# Altium schematic sheet LTC3862-2.SchDoc
size 431 x 279 mm; SheetNumber: 2; SheetTotal: 4
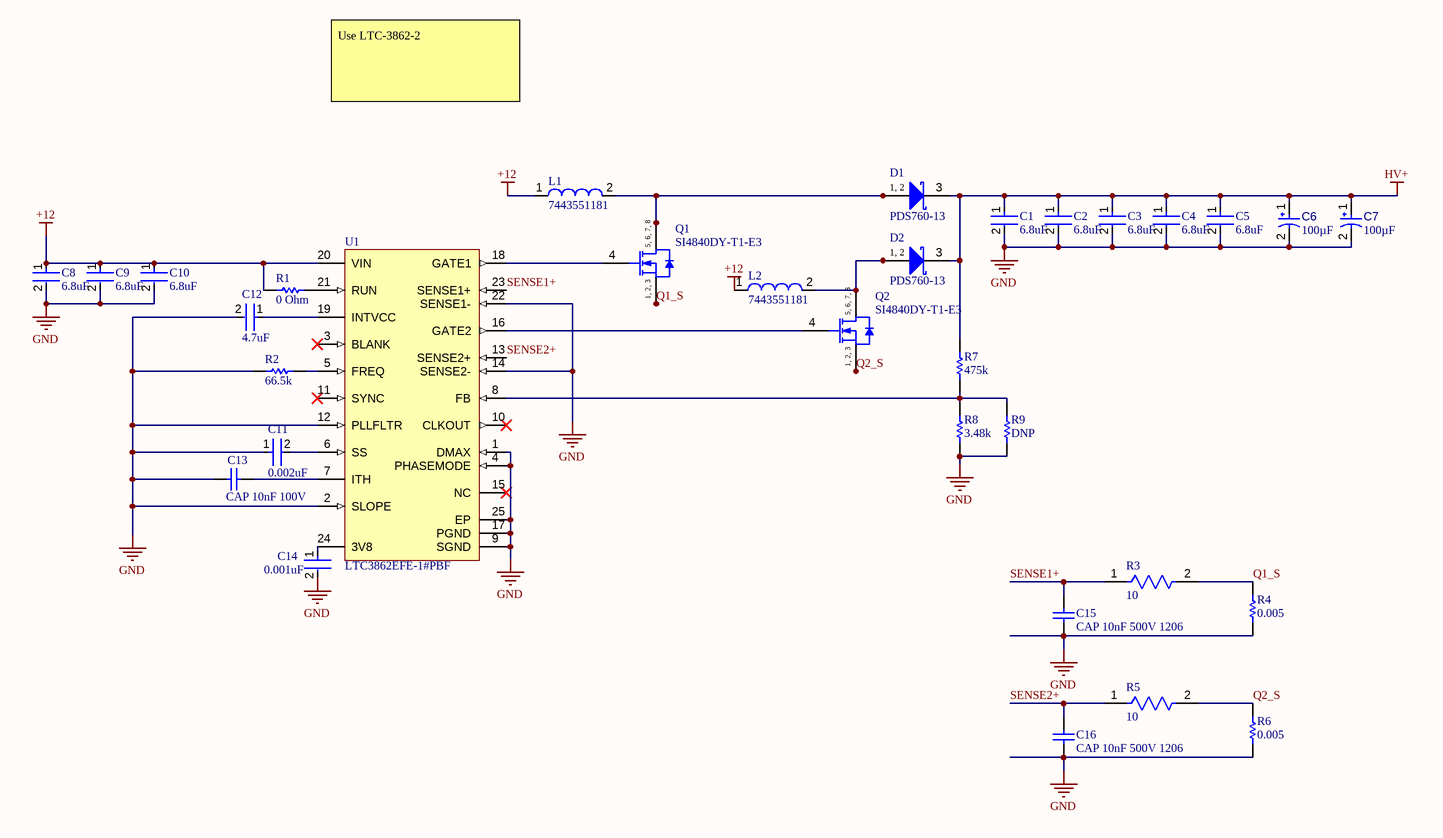
[diagram p0: LTC3862-2.SchDoc]

## Parts
C1  6.8uF  [FP-C3216-160-0_2-MFG]
C2  6.8uF  [FP-C3216-160-0_2-MFG]
C3  6.8uF  [FP-C3216-160-0_2-MFG]
C4  6.8uF  [FP-C3216-160-0_2-MFG]
C5  6.8uF  [FP-C3216-160-0_2-MFG]
C6  value 100µF  [CAPPR65-500-1600X1000X1700]  (hidden comment: ECA-2DM101)
C7  value 100µF  [CAPPR65-500-1600X1000X1700]  (hidden comment: ECA-2DM101)
C8  6.8uF  [FP-C3216-160-0_2-IPC_B]
C9  6.8uF  [FP-C3216-160-0_2-IPC_B]
C10  6.8uF  [FP-C3216-160-0_2-IPC_B]
C11  0.002uF  [FP-C1206C-EB-MFG]
C12  4.7uF  [FP-GRM31C-0_2-e0_3_0_8-IPC_C]
C13  CAP 10nF 100V  [CAPC1206(3216)170_N]
C14  0.001uF  [FP-C1206C-EB-MFG]
C15  CAP 10nF 500V 1206  [CAPC1206(3216)170_N]
C16  CAP 10nF 500V 1206  [CAPC1206(3216)170_N]
D1  PDS760-13  [DIOD-POWERDI5-3_V]
D2  PDS760-13  [DIOD-POWERDI5-3_V]
L1  7443551181  [WE-HCI-1365]
L2  7443551181  [WE-HCI-1365]
Q1  SI4840DY-T1-E3  [VISH-SOIC-8_A_V]
Q2  SI4840DY-T1-E3  [VISH-SOIC-8_A_V]
R1  0 Ohm  [RESC3216X89X64LL25T25]
R2  66.5k  [RESC3216X70X50NL05T20]
R3  10  [FP-CRCW1206-e3-IPC_A]
R4  0.005  [RESC3216X89X64LL25T25]
R5  10  [FP-CRCW1206-e3-IPC_A]
R6  0.005  [RESC3216X89X64LL25T25]
R7  475k  [RESC3216X60X45LL10T20]
R8  3.48k  [RESC3216X70X50LL05T20]
R9  DNP  [RESC3216X70X50LL05T20]
U1  LTC3862EFE-1#PBF  [LT-FE-24-EPV-AA_M]

## Nets
+12: C8.1 C9.1 C10.1 L1.1 L2.1 R1.1 U1.20(VIN)
GND: C1.2 C2.2 C3.2 C4.2 C5.2 C6.2 C7.2 C8.2 C9.2 C10.2 C11.1 C12.2 C13.2 C14.2 C15.2 C16.2 R2.1 R4.1 R6.1 R8.1 R9.1 U1.1(DMAX) U1.2(SLOPE) U1.4(PHASEMODE) U1.9(SGND) U1.12(PLLFLTR) U1.14(SENSE2-) U1.17(PGND) U1.22(SENSE1-) U1.25(EP)
HV+: C1.1 C2.1 C3.1 C4.1 C5.1 C6.1 C7.1 D1.3(K) D2.3(K) R7.2
Q1_S: Q1.1(S) Q1.2(S) Q1.3(S) R3.2 R4.2
Q2_S: Q2.1(S) Q2.2(S) Q2.3(S) R5.2 R6.2
SENSE1+: C15.1 R3.1 U1.23(SENSE1+)
SENSE2+: C16.1 R5.1 U1.13(SENSE2+)
NetC11_2: C11.2 U1.6(SS)
NetC12_1: C12.1 U1.19(INTVCC)
NetC13_1: C13.1 U1.7(ITH)
NetC14_1: C14.1 U1.24(3V8)
NetD1_1: D1.1(A) D1.2(A) L1.2 Q1.5(D) Q1.6(D) Q1.7(D) Q1.8(D)
NetD2_1: D2.1(A) D2.2(A) L2.2 Q2.5(D) Q2.6(D) Q2.7(D) Q2.8(D)
NetQ1_4: Q1.4(G) U1.18(GATE1)
NetQ2_4: Q2.4(G) U1.16(GATE2)
NetR1_2: R1.2 U1.21(RUN)
NetR2_2: R2.2 U1.5(FREQ)
NetR7_1: R7.1 R8.2 R9.2 U1.8(FB)

Not connected (* = marked no-connect by the designer): U1 3(BLANK)* 10(CLKOUT)* 11(SYNC)* 15(NC)*

## Notes on the sheet
- Use LTC-3862-2
- DWG. NO.
- REV.
- SHT.
- THIS DOCUMENT AND THE DATA DISCLOSED HEREIN OR HEREWITH IS THE PROPERTY OF ALTIUM LIMITED AND MAY BE FREELY DISTRIBUTED IN WHOLE. NO RIGHTS ARE RESERVED OR EXPRESS OR IMPLIED WARANTEE GIVEN.
- REVISION
- DESCRIPTION
- DATE
- APPROVED
- ENG:
- APPROVALS
- PROJECT
- DSN:
- CHK:
- REFERENCE DOCUMENTS
- PROJECT REVISION:
- TITLE
- DOCUMENT REVISION:
- DESIGN ITEM:
- BOM:
- FAB DWG:
- PCB DWG:
- ASSY DWG:
- SCALE:
- SIZE
- B
- CAGE CODE
- FILE NAME
- DWG NO.
- SHEET
- OF
- REV
- (in symbol CMP-2000-07056-1) 5, 6, 7, 8; 1, 2, 3
- (in symbol CMP-2000-07476-1) 1, 2

## Library data of the parts
C1-C5 = CMP-08246-003319-1: Multilayer Ceramic Capacitors 6.8uF ±20% 50V X5R SMD 1206 / C3216X5R1H685M160AB; Max Operating Temperature: 85°C; Min Operating Temperature: -55°C; Resistor Type: Ceramic; Thickness: 0.071inch; Capacitance: 6.8uF; Voltage Rating (DC): 50V; Length: 3.2mm; RoHS Compliant: Yes; Case/Package: 1206; Case Code (Metric): 3216; Series: C; Termination: SMD/SMT; Package Quantity: 1; Dielectric Material: Ceramic; Depth: 1.6mm; Mount: Surface Mount; Height: 1.6mm; Dielectric: X5R; Weight: 0.000571oz; Packaging: Tape and Reel; Lead Free: Lead Free; Tolerance: 20%; Construction: Flat; Width: 0.063inch; Case Code (Imperial): 1206; Voltage Rating: 50V
C6 C7 = CMP-001-00034-5: Aluminum Electrolytic Capacitor, 100 uF, +/- 20%, 200 V, -40 to 85 degC, 2-Pin THD, RoHS, Bulk; Manufacturer: Panasonic; Voltage Rating: 100V; Ripple Current (AC): 350mA; Mounting Technology: TH; RoHS Compliant: True; Package Reference: CAPPR65-500-1600X1000X1700; Lead Pitch: 5mm; Manufacturer URL: http://www.panasonic.com/; Min Operating Temperature: -40°C; Package Quantity: 200; Capacitor Type: Electrolytic; Diameter: 10mm; Packaging: Bulk; Datasheet URL: https://industrial.panasonic.com/cdbs/www-data/pdf/RDF0000/ABA0000C1047.pdf; Max Operating Temperature: 85°C; Pins: 2; Case/Package: Radial; Package Description: 2-Pin Through Hole Device, Dia 10 mm, Body Length 16 mm; Ripple Current: 350mA; Tolerance: 20%; Datasheet Version: Mar-16
C8-C10 = CMP-08246-003250-1: Multilayer Ceramic Capacitors 6.8uF ±10% 25V X7R SMD 1206 / C3216X7R1E685K160AB; Series: C; Construction: Flat; Max Operating Temperature: 125°C; Height: 1.6mm; Depth: 1.6mm; REACH SVHC: No SVHC; Lead Free: Lead Free; Dielectric Material: Ceramic; Length: 3.2mm; Dielectric: X7R; RoHS Compliant: Yes; Package Quantity: 1; Number of Pins: 2; Termination: SMD/SMT; Capacitance: 6.8uF; Min Operating Temperature: -55°C; Voltage Rating: 25V; Tolerance: 10%; Width: 0.063inch; Case Code (Imperial): 1206; Mount: Surface Mount; Resistor Type: Ceramic; Packaging: Tape and Reel; Weight: 0.000571oz; Voltage Rating (DC): 25V; Case/Package: 1206; Thickness: 0.075inch; Case Code (Metric): 3216
C11 = CMP-1037-02760-2: C1206 2,000 pF C0G 5.00% 100 V / C1206C202J1GACTU; Manufacturer: KEMET; Voltage Rating: 100 V; Tolerance: 0.05; Temperature Coefficient: 15%; Material: Ceramic; Automotive Grade: Grade 0; ComponentLink2URL: https://content.kemet.com/datasheets/KEM_C1007_X8R_ULTRA_150C_SMD.pdf; Device Class L3: Ceramic Capacitors; Temperature Characteristic: C0G; Category: Cap; RoHS: TRUE; Mouser Description: Cap Ceramic 0.002uF 100V C0G 5% SMD 1206 125°C Plastic T/R; Temperature Range Low: -55°C; Device Class L2: Capacitors; Temperature: -55°C to +150°C; Temperature Range High: +150°C; Ipc Land Pattern Name: CAPC320160X78; ComponentLink2Description: Datasheet; Octopart: https://octopart.com/c1206c202j1gactu-kemet-16997314; Device Class L1: Passive Components; Capacitance: 2,000 pF; Automotive: Yes; Manufacturer Part Number: C1206C202J1GACTU; Package: C1206C-EB; Height: 0.88mm; Value: 2,000 pF; Lead Free: Yes
C12 = CMP-1037-04923-3: Chip Multilayer Ceramic Capacitors for General Purpose, 1206, 4.7uF, X7R, 15%, 10%, 50V; Height: 1.6mm; Voltage: 50V; Capacitance: 4.7uF; Lead Free: Lead Free; Max Operating Temperature: 125°C; Packaging: Tape and Reel; REACH SVHC: No SVHC; Voltage Rating: 50V; Mount: Surface Mount; Termination: SMD/SMT; Tolerance: 10%; Case/Package: 1206; Material: Ceramic; Depth: 1.6mm; Length: 3.2mm; Case Code (Metric): 3216; Voltage Rating (DC): 50V; Case Code (Imperial): 1206; Radiation Hardening: No; Width: 0.063inch; Thickness: 0.071inch; Package Quantity: 2000; Min Operating Temperature: -55°C; Dielectric: X7R
C13 = CMP-1037-03519-1: CAP 10nF 100V ±5% 1206 (3216 Metric) Thickness 1.7mm SMD; Tolerance: Â±5%; Case-EIA: 1206; Case-Metric: 3216; Rated Voltage: 100 V; Value: 10nF; Technology: SMT; Max Thickness: 1.7 mm
C14 = CMP-03020-027220-1: 1206 1000pF Ceramic Multilayer Capacitor; 50VDC; 125degC; C0G Dielec; +/-5% SMD / C1206C102J5GACTU; Manufacturer: KEMET; Value: 1,000 pF; Voltage Rating: 50 V; Temperature Coefficient: 15%; Automotive Grade: Grade 0; Tolerance: 0.05; RoHS: TRUE; Category: Cap; Manufacturer Part Number: C1206C102J5GACTU; Temperature Range Low: -55°C; Digikey Description: 1206 1000pF Ceramic Multilayer Capacitor; 50VDC; 125degC; C0G Dielec; +/-5% SMD; ComponentLink2URL: https://content.kemet.com/datasheets/KEM_C1007_X8R_ULTRA_150C_SMD.pdf; Device Class L1: Passive Components; Device Class L3: Ceramic Capacitors; Temperature Characteristic: C0G; ComponentLink2Description: Datasheet; Height: 0.88mm; Automotive: Yes; Mouser Description: Multilayer Ceramic Capacitors MLCC - SMD/SMT 50volts 1000pF C0G 5%; Material: Ceramic; Capacitance: 1,000 pF; Lead Free: Yes; Device Class L2: Capacitors; Octopart: https://octopart.com/c1206c102j5gactu-kemet-139939; Temperature: -55°C to +150°C; Temperature Range High: +150°C; Ipc Land Pattern Name: CAPC320160X78; Package: C1206C-EB
C15 C16 = CMP-1037-03540-1: CAP 10nF 500V ±10% 1206 (3216 Metric) Thickness 1.7mm SMD; Tolerance: Â±10%; Case-Metric: 3216; Case-EIA: 1206; Rated Voltage: 500 V; Value: 10nF; Max Thickness: 1.7 mm; Technology: SMT
D1 D2 = CMP-2000-07476-1: Schottky Barrier Rectifier, 60 V, 7 A, -65 to 150 degC, 3-Pin SMD, RoHS, Tape and Reel; Manufacturer: Diodes Inc; Max Repetitive Reverse Voltage (Vrrm): 60V; Element Configuration: CommonAnode; Max Forward Surge Current (Ifsm): 275A; Polarity: Standard; Forward Voltage: 620mV; Forward Current: 7A; Peak Reverse Current: 200uA; Case\/Package: SMD/SMT; Manufacturer URL: http://www.diodes.com/; Reverse Voltage (DC): 60V; Lead Free: LeadFree; Voltage Rating (DC): 60V; Min Operating Temperature: -65degC; Package Description: 3-Pin Surface Mount Device, Body 3.975 x 5.375 mm, Pitch 1.84 mm; Length: 4.05mm; Datasheet URL: https://www.diodes.com/assets/Datasheets/ds30477.pdf; REACH SVHC: NoSVHC; Peak Non-Repetitive Surge Current: 275A; Output Current: 7A; Contact Plating: Matte; Mounting Technology: SurfaceMount; Mount: SurfaceMount; RoHSCompliant: true; Weight: 0.003386oz; Current Rating: 7A; Max Operating Temperature: 150degC; Package Quantity: 5000; Height: 1.15mm; Average Rectified Current: 7A; Datasheet Version: Rev. 13-2, 10/2012; Number of Pins: 5; Width: 5.45mm; Packaging: TapeandReel; Radiation Hardening: No; Package Reference: POWERDI5-3
L1 L2 = CMP-1351-00013-1: SMD Flat Wire High Current Inductor WE-HCI, L=18.0 µH; Manufacturer: Wuerth Elektronik; Inductance: 18.0 ÂµH; ComponentLink2URL: http://katalog.we-online.de/kataloge/eisos/media/pdf/7443551181.pdf; ComponentLink1URL: http://www.we-online.com; PartNumber: 7443551181; ComponentLink2Description: Datasheet; ComponentLink1Description: Manufacturer URL; PackageReference: WE-HCI-1365; PackageDescription: Inductor, 2-Leads, Body 13.2 x 12.8 mm
Q1 Q2 = CMP-2000-07056-1: N-Channel MOSFET, 40 V, -55 to 150 degC, 8-Pin SOIC, RoHS, Tape and Reel; Manufacturer: Vishay; Channel Type: N; Typical Gate Charge @ Vgs: 18.5nCV@5; Maximum Power Dissipation: 1.56W; Typical Turn-On Delay Time: 15ns; Configuration: QuadDrain,Single,TripleSource; Channel Mode: Enhancement; Typical Turn-Off Delay Time: 50ns; Maximum Drain Source Resistance: 0.009; Number of Elements per Chip: 1; Maximum Gate Source Voltage: 20V; Maximum Continuous Drain Current: 10A; Maximum Drain Source Voltage: 40V; Height: 1.55mm; Category: PowerMOSFET; Maximum Operating Temperature: +150C; Width: 4mm; Length: 5mm; Datasheet Version: Rev. E, 05/2009; Mounting Type: SurfaceMount; Package Type: SOICN; Dimensions: 5x4x1.55mm; Minimum Operating Temperature: -55C; Package Description: 8-Pin Small Outline Integrated Circuit, Body 4.9 x 3.9 mm, Pitch 1.27 mm; Pin Count: 8; Package Reference: SOIC-8; Datasheet URL: http://www.vishay.com/docs/71188/71188.pdf; Package URL: http://www.vishay.com/docs/71192/71192.pdf; Mounting Technology: SurfaceMount; Manufacturer URL: http://www.vishay.com/
R1 = CMP-2003-04332-1: 0 ohm 1206 / WSL120600000ZEA9; Manufacturer: Vishay Dale; Part Number: WSL120600000ZEA9
R2 = CMP-2003-00464-1: ERJ-8ENF6652V; Manufacturer: Panasonic; Part Number: ERJ-8ENF6652V
R3 R5 = CMP-2003-04815-2: RES Thick Film, 10Ω, 1%, 0.25W, 100ppm/°C, 1206 / CRCW120610R0FKEA; Power Rating: 250mW; Voltage Rating (DC): 200V; Resistance: 10R; Number of Terminations: 2; Width: 0.063inch; Case Code (Imperial): 1206; Depth: 1.6mm; Contact Plating: Tin; Radiation Hardening: No; Lead Free: Lead Free; Length: 3.2mm; Tolerance: 1%; Max Power Dissipation: 250mW; Composition: Thick Film; Weight: 0.000353oz; Case/Package: 1206; Number of Pins: 2; Package Quantity: 10; Min Operating Temperature: -55°C; Military Standard: Not; Max Operating Temperature: 155°C; Termination: SMD/SMT; Case Code (Metric): 3216; Voltage Rating: 200V; Height: 0.55mm; Features: Automotive AEC-Q200; Temperature Coefficient: 100ppm/°C; Packaging: Tape and Reel
R4 R6 = CMP-2003-04338-1: WSLP12065L000FEA; Manufacturer: Vishay Dale; Part Number: WSLP12065L000FEA
R7 = CMP-2003-02210-1: CRCW1206475KFKEA; Manufacturer: Vishay Dale; Part Number: CRCW1206475KFKEA
R8 = CMP-2003-00318-1: ERJ-8ENF3481V; Manufacturer: Panasonic; Part Number: ERJ-8ENF3481V
R9 = CMP-2003-00318-1: Manufacturer: Panasonic; Part Number: ERJ-8ENF3481V
U1 = CMP-0492-00585-1: Multi-Phase Current Mode Step-Up DC/DC Controller, 10 V IntVcc, 7.5 V UV+, 7 V UV-, 24-pin SOP (FE-24-EPV-AA), -40 to 125 degC, Pb-Free; Manufacturer: Linear Technology; Frequency Sync Range: 50kHz - 650kHz; Number of Outputs: 1; ComponentLink2Description: Datasheet; PackageReference: FE-24; ComponentLink3URL: http://cds.linear.com/docs/en/packaging/TSSOP_24_05-08-1771.pdf; ComponentLink3Description: Package Specification; Mounting Technology: Surface Mount; ComponentLink2URL: http://cds.linear.com/docs/en/datasheet/38621f.pdf; PartNumber: LTC3862EFE-1#PBF; RoHS: TRUE; ComponentLink1Description: Manufacturer URL; ComponentLink1URL: http://www.linear.com/; PackageVersion: Rev. B, 09/2010; PackageDescription: 24-Pin Plastic TSSOP, Body 7.8 x 4.4 mm, Pitch 0.65 mm